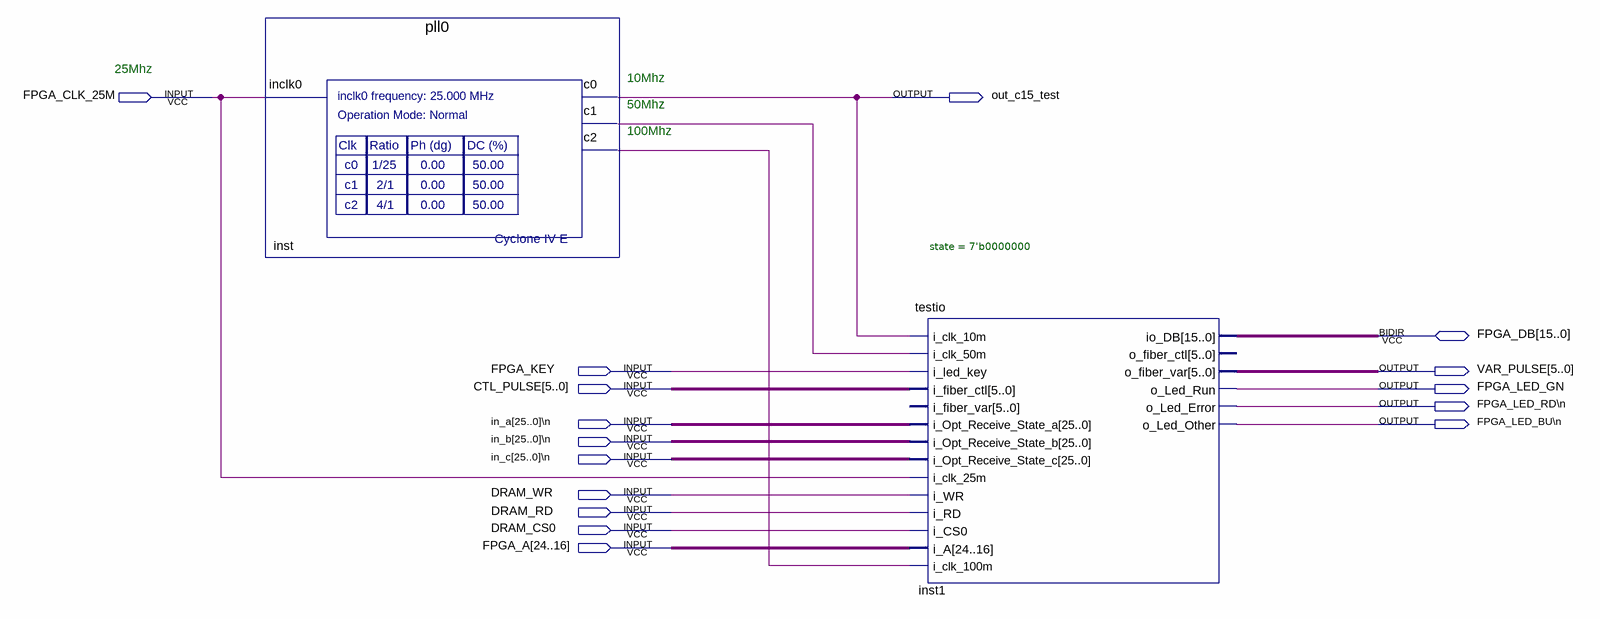
[diagram p0: schematic sheet]
// Quartus schematic breakdown.bdf as structural Verilog: 2 symbols, 16 pins
module breakdown (
  input  FPGA_CLK_25M,
  input  FPGA_KEY,
  input  [5:0] CTL_PULSE,
  input  \in_a[25..0]\n ,
  input  \in_b[25..0]\n ,
  input  \in_c[25..0]\n ,
  input  DRAM_WR,
  input  DRAM_RD,
  input  DRAM_CS0,
  input  [24:16] FPGA_A,
  inout  [15:0] FPGA_DB,
  output out_c15_test,
  output [5:0] VAR_PULSE,
  output FPGA_LED_GN,
  output \FPGA_LED_RD\n ,
  output \FPGA_LED_BU\n 
);

  wire inst_c1, inst_c2;
  wire [25:0] undriven, undriven_2, undriven_3;

  pll0 inst (.inclk0(FPGA_CLK_25M), .c0(out_c15_test), .c1(inst_c1), .c2(inst_c2));
  testio #(.state(7'b0000000)) inst1 (
    .i_clk_10m(out_c15_test), .i_clk_50m(inst_c1), .i_led_key(FPGA_KEY), .i_fiber_ctl(CTL_PULSE),
    .i_Opt_Receive_State_a(undriven), .i_Opt_Receive_State_b(undriven_2), .i_Opt_Receive_State_c(undriven_3),
    .i_clk_25m(FPGA_CLK_25M), .i_WR(DRAM_WR), .i_RD(DRAM_RD), .i_CS0(DRAM_CS0), .i_A(FPGA_A),
    .i_clk_100m(inst_c2), .o_fiber_var(VAR_PULSE), .o_Led_Run(FPGA_LED_GN), .o_Led_Error(\FPGA_LED_RD\n ),
    .o_Led_Other(\FPGA_LED_BU\n ), .io_DB(FPGA_DB));  // open: i_fiber_var, o_fiber_ctl

  // Notes on the sheet:
  //   25Mhz
  //   10Mhz
  //   50Mhz
  //   100Mhz
endmodule
